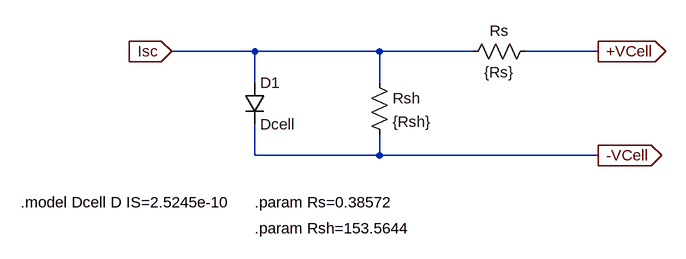
[diagram p0: schematic cell_photovoltaic_unit.asc]
cell_photovoltaic_unit.asc, the LTspice schematic file:
Version 4
SHEET 1 880 680
WIRE -352 -48 -480 -48
WIRE -160 -48 -352 -48
WIRE -16 -48 -160 -48
WIRE 176 -48 64 -48
WIRE -352 0 -352 -48
WIRE -160 0 -160 -48
WIRE -352 112 -352 64
WIRE -160 112 -160 80
WIRE -160 112 -352 112
WIRE 176 112 -160 112
FLAG -480 -48 Isc
IOPIN -480 -48 In
FLAG 176 -48 +VCell
IOPIN 176 -48 Out
FLAG 176 112 -VCell
IOPIN 176 112 Out
SYMBOL diode -368 0 R0
SYMATTR InstName D1
SYMATTR Value Dcell
SYMBOL res -176 -16 R0
SYMATTR InstName Rsh
SYMATTR Value {Rsh}
SYMBOL res 80 -64 R90
WINDOW 0 0 56 VBottom 2
WINDOW 3 32 56 VTop 2
SYMATTR InstName Rs
SYMATTR Value {Rs}
TEXT -352 184 Left 2 !.param Rs=0.38572
TEXT -352 224 Left 2 !.param Rsh=153.5644
TEXT -712 184 Left 2 !.model Dcell D IS=2.5245e-10

The netlist it stands for:
* cell_photovoltaic_unit.asc
D1 Isc -VCell Dcell
Rsh Isc -VCell {Rsh}
Rs +VCell Isc {Rs}
.model D D
.lib standard.dio
.param Rs=0.38572
.param Rsh=153.5644
.model Dcell D IS=2.5245e-10
.backanno
.end